# Altium schematic sheet fpga_ft232h.SchDoc
size A4
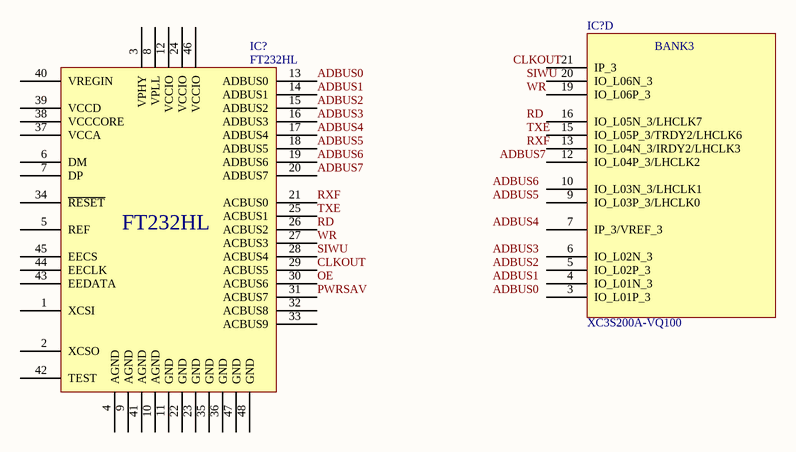
[diagram p0: fpga_ft232h.SchDoc]

## Parts
(Parts that share a designator on the sheet are numbered #1, #2 ... from top to bottom, then left to right.)
IC?#1  XC3S200A-VQ100  [VQ100]  (part D of 6)
IC?#2  FT232HL  [LQFP-48_L]

## Nets
ADBUS0: IC?#2.13(ADBUS0)
ADBUS1: IC?#2.14(ADBUS1)
ADBUS2: IC?#2.15(ADBUS2)
ADBUS3: IC?#2.16(ADBUS3)
ADBUS4: IC?#2.17(ADBUS4)
ADBUS5: IC?#2.18(ADBUS5)
ADBUS6: IC?#2.19(ADBUS6)
ADBUS7: IC?#2.20(ADBUS7)
CLKOUT: IC?#2.29(ACBUS5)
OE: IC?#2.30(ACBUS6)
PWRSAV: IC?#2.31(ACBUS7)
RD: IC?#2.26(ACBUS2)
RXF: IC?#2.21(ACBUS0)
SIWU: IC?#2.28(ACBUS4)
TXE: IC?#2.25(ACBUS1)
WR: IC?#2.27(ACBUS3)

Not connected (* = marked no-connect by the designer): IC?#1 3(IO_L01P_3) 4(IO_L01N_3) 5(IO_L02P_3) 6(IO_L02N_3) 7(IP_3/VREF_3) 9(IO_L03P_3/LHCLK0) 10(IO_L03N_3/LHCLK1) 12(IO_L04P_3/LHCLK2) 13(IO_L04N_3/IRDY2/LHCLK3) 15(IO_L05P_3/TRDY2/LHCLK6) 16(IO_L05N_3/LHCLK7) 19(IO_L06P_3) 20(IO_L06N_3) 21(IP_3); IC?#2 1(XCSI) 2(XCSO) 3(VPHY) 4(AGND) 5(REF) 6(DM) 7(DP) 8(VPLL) 9(AGND) 10(AGND) 11(GND) 12(VCCIO) 22(GND) 23(GND) 24(VCCIO) 32(ACBUS8) 33(ACBUS9) 34(~{RESET}) 35(GND) 36(GND) 37(VCCA) 38(VCCCORE) 39(VCCD) 40(VREGIN) 41(AGND) 42(TEST) 43(EEDATA) 44(EECLK) 45(EECS) 46(VCCIO) 47(GND) 48(GND)

## Notes on the sheet
- Labels drawn without touching a wire or pin: ADBUS0, ADBUS1, ADBUS2, ADBUS3, ADBUS4, ADBUS5, ADBUS6, ADBUS7, CLKOUT, RD, RXF, SIWU, TXE, WR
- (in symbol XC3S200A-VQ100, part D) BANK3